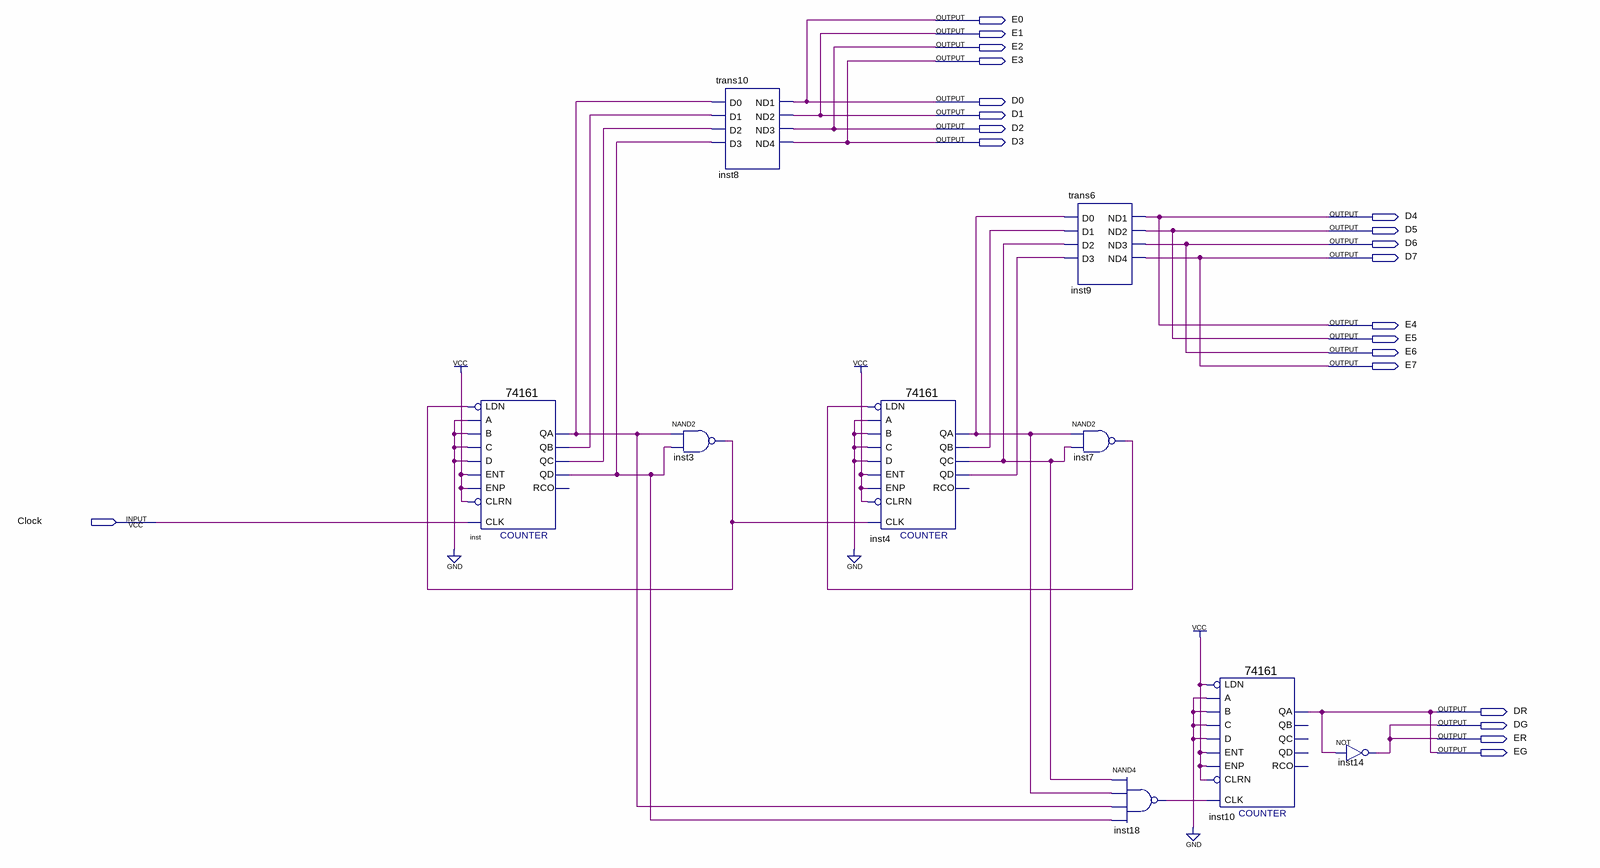
[diagram p0: schematic sheet]
// Quartus schematic Countdown.bdf as structural Verilog: 9 symbols, 21 pins
module Countdown (
  input  Clock,
  output E0,
  output E1,
  output E2,
  output E3,
  output D0,
  output D1,
  output D2,
  output D3,
  output D4,
  output D5,
  output D6,
  output D7,
  output E4,
  output E5,
  output E6,
  output E7,
  output DR,
  output DG,
  output ER,
  output EG
);

  wire inst3_out, inst4_qa, inst4_qb, inst4_qc, inst4_qd, inst7_out, inst18_out, inst_qa, inst_qb, inst_qc,
       inst_qd;

  \74161  inst (
    .CLRN(1'b1), .CLK(Clock), .ENP(1'b1), .LDN(inst3_out), .A(1'b0), .D(1'b0), .ENT(1'b1), .B(1'b0),
    .C(1'b0), .QD(inst_qd), .QC(inst_qc), .QB(inst_qb), .QA(inst_qa));  // open: RCO
  nand inst3 (inst3_out, inst_qa, inst_qd);
  trans10 inst8 (.D0(inst_qa), .D1(inst_qb), .D2(inst_qc), .D3(inst_qd), .ND1(D0), .ND2(D1), .ND3(D2), .ND4(D3));
  \74161  inst4 (
    .CLRN(1'b1), .CLK(inst3_out), .ENP(1'b1), .LDN(inst7_out), .A(1'b0), .D(1'b0), .ENT(1'b1), .B(1'b0),
    .C(1'b0), .QD(inst4_qd), .QC(inst4_qc), .QB(inst4_qb), .QA(inst4_qa));  // open: RCO
  trans6 inst9 (.D0(inst4_qa), .D1(inst4_qb), .D2(inst4_qc), .D3(inst4_qd), .ND1(D4), .ND2(D5), .ND3(D6), .ND4(D7));
  nand inst7 (inst7_out, inst4_qa, inst4_qc);
  nand inst18 (inst18_out, inst4_qc, inst4_qa, inst_qa, inst_qd);
  \74161  inst10 (
    .CLRN(1'b1), .CLK(inst18_out), .ENP(1'b1), .LDN(1'b1), .A(1'b0), .D(1'b0), .ENT(1'b1), .B(1'b0),
    .C(1'b0), .QA(DR));  // open: QD, QC, QB, RCO
  not inst14 (DG, DR);

  assign E0 = D0;
  assign E1 = D1;
  assign E2 = D2;
  assign E3 = D3;
  assign E4 = D4;
  assign E5 = D5;
  assign E6 = D6;
  assign E7 = D7;
  assign EG = DR;
  assign ER = DG;
endmodule
